# EAGLE design PCI Driver Shield v9001 (EAGLE 9.0.1)
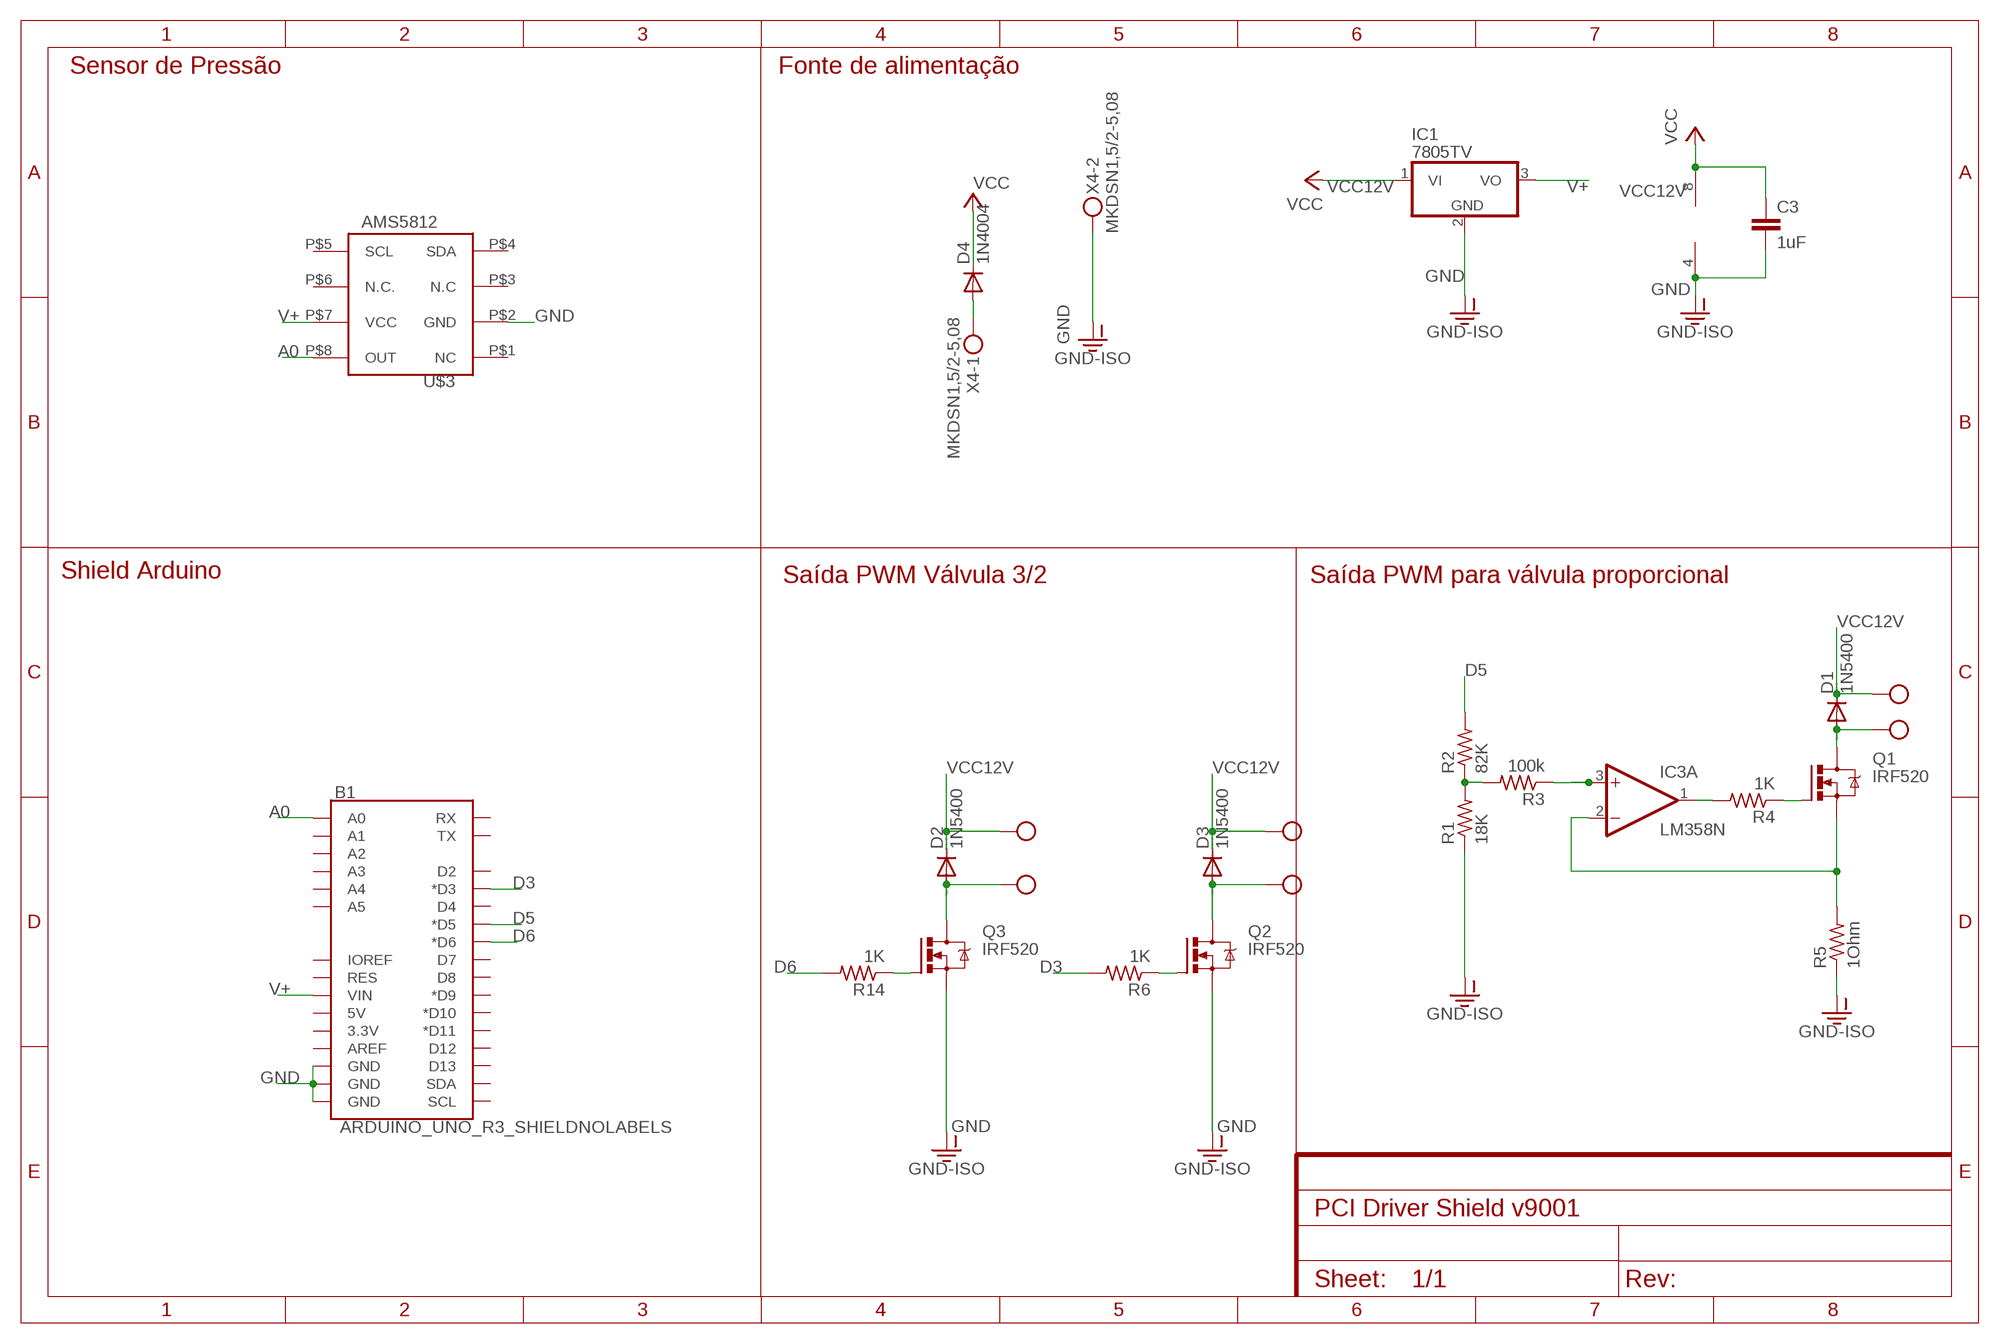
[diagram p0: schematic, sheet 1]

## Parts
B1  ARDUINO_UNO_R3_SHIELDNOLABELS  [UNO_R3_SHIELD_NOLABELS]
C3  1uF  C2.5/4  [C2.5-4]
D1  1N5400  [DO201-15]
D2  1N5400  [DO201-15]
D3  1N5400  [DO201-15]
D4  1N4004  [DO41-10]
IC1  7805TV  [TO220V]
IC3  LM358N  [DIL08]
Q1  IRF520  [TO220BV]
Q2  IRF520  [TO220BV]
Q3  IRF520  [TO220BV]
R1  18K  R-US_0204/7  [0204/7]
R2  82K  R-US_0204/7  [0204/7]
R3  100k  R-US_0204/7  [0204/7]
R4  1K  R-US_0204/7  [0204/7]
R5  1Ohm  R-US_0204/7  [0204/7]
R6  1K  R-US_0204/7  [0204/7]
R14  1K  R-US_0204/7  [0204/7]
S1  MKDSN1,5/2-5,08  [MKDSN1,5/2-5,08]
S2  MKDSN1,5/2-5,08  [MKDSN1,5/2-5,08]
S3  MKDSN1,5/2-5,08  [MKDSN1,5/2-5,08]
U$3  AMS5812  [AMS5812]
X4  MKDSN1,5/2-5,08  [MKDSN1,5/2-5,08]

## Nets
A0: B1.A0 U$3.P$8(OUT)
D3: B1.D3(*D3) R6.2
D5: B1.D5(*D5) R2.2
D6: B1.D6(*D6) R14.2
GND: B1.GND@0(GND) B1.GND@1(GND) B1.GND@2(GND) C3.2 IC1.2(GND) IC3.4(P:V-) Q2.S Q3.S R1.1 R5.1 U$3.P$2(GND) X4.2 ; supply symbol labelled GND-ISO
GNDS1: IC3.2(A:-IN) Q1.S R5.2
N$1: D2.A Q3.D S2.1
N$2: R1.2 R2.1 R3.2
N$3: Q1.G R4.1
N$4: Q2.G R6.1
N$5: D3.A Q2.D S3.1
N$6: IC3.1(A:OUT) R4.2
N$7: D1.A Q1.D S1.1
N$8: IC3.3(A:+IN) R3.1
N$9: D4.A X4.1
N$15: Q3.G R14.1
V+: B1.VIN IC1.3(VO) U$3.P$7(VCC)
VCC12V: C3.1 D1.C D2.C D3.C D4.C IC1.1(VI) IC3.8(P:V+) S1.2 S2.2 S3.2 ; supply symbol labelled VCC
Unconnected: B1.3.3V B1.5V B1.A1 B1.A2 B1.A3 B1.A4 B1.A5 B1.AREF B1.D2 B1.D4 B1.D7 B1.D8 B1.D9(*D9) B1.D10(*D10) B1.D11(*D11) B1.D12 B1.D13 B1.IOREF B1.RES B1.RX B1.SCL B1.SDA B1.TX IC3.5(B:+IN) IC3.6(B:-IN) IC3.7(B:OUT) U$3.P$1(NC) U$3.P$3(N.C) U$3.P$4(SDA) U$3.P$5(SCL) U$3.P$6(N.C.)

## Notes on the sheet
- Sensor de Pressão | Fonte de alimentação
- Shield Arduino | Saída PWM Válvula 3/2 | Saída PWM para válvula proporcional

## Library data of the parts
B1 = SparkFun-Boards:ARDUINO_UNO_R3_SHIELD: Arduino R3 Shield Footprint Shield form compatible with the Arduino Uno R3. SparkFun Products: MG2639 Cellular Shield <https://www.sparkfun.com/products/13120> MIDI Shield <https://www.sparkfun.com/products/12898> R3 Stackable Headers Kit <https://www.sparkfun.com/products/11417>
C3 = capacitor-wima:C: CAPACITOR naming: grid - package width
D1-D3 = diode:1N5400: DIODE standard rectifier, 3 A, 50 V (Motorola)
D4 = adafruit:1N4004: DIODE General purpose 1N400x type rectifier (With bigger pads) http://www.ladyada.net/library/pcb/eaglelibrary.html
IC1 = linear:78*: Positive VOLTAGE REGULATOR Source: http://cache.national.com/ds/LM/LM78L05.pdf http://www.fairchildsemi.com/ds/LM/LM7805.pdf
IC3 = linear:LM358: OP AMP also LM158; LM258; LM2904 Source: http://cache.national.com/ds/LM/LM158.pdf; SPICEPREFIX: J
Q1 = transistor-power:IRF520: HEXFET Power MOSFET; SPICEPREFIX: Q
Q2 Q3 = transistor-power:IRF520: HEXFET Power MOSFET
R1-R3 R5 R6 R14 = resistor:R-US_: RESISTOR, American symbol
R4 = resistor:R-US_: RESISTOR, American symbol; SPICEPREFIX: R
S1-S3 X4 = con-phoenix-508:MKDSN1,5/2-5,08: MKDSN 1,5/ 2-5,08 Printklemme Nennstrom: 13,5 A Nennspannung: 250 V Rastermaß: 5,08 mm Polzahl: 2 Anschlussart: Schraubanschluss Montage: Löten Anschlussrichtung Leiter/Platine: 0 ° Artikelnummer: 1729128 Source: http://eshop.phoenixcontact.com .. 1729128.pdf
U$3 = AMS:AMS5812: AMS 5812 pressure sensors are a series of highprecision OEM sensors with an analog 0.5 – 4.5 V voltage output and a digital I2C-interface. They are calibrated and compensated for across a wide temperature range of -25 to +85°C. AMS 5812 comes as a dual in-line package (DIP) for assembly on printed circuit boards (PCBs) and is fully operational without the need for any additional components. The electrical connection is made via the DIP solder pins; pressure is connected via two vertical metal tubes. AMS 5812 combines micromachined, high quality piezoresistive measuring cells with a modern, signal conditioning mixed-signal ASIC on a ceramic substrate. This enables high precision measurements and excellent drift and long-term stability. The sensors in the AMS 5812 series are available for various applications and pressure ranges: differential (relative) devices in pressure ranges from 0 – 0.075 PSI up to 0 – 100 PSI, absolute pressure variants for 0 – 15 PSI, 0 - 30 PSI and a barometric type. Bidirectional differential devices are available from -0.075 /+ 0.075 PSI up to -15/ +15 PSI. Custom specific pressure ranges and modifications are available on request.

## Net classes
0 default: width 1.016 mm, drill 0.152 mm, clearance 0.457 mm

## Board
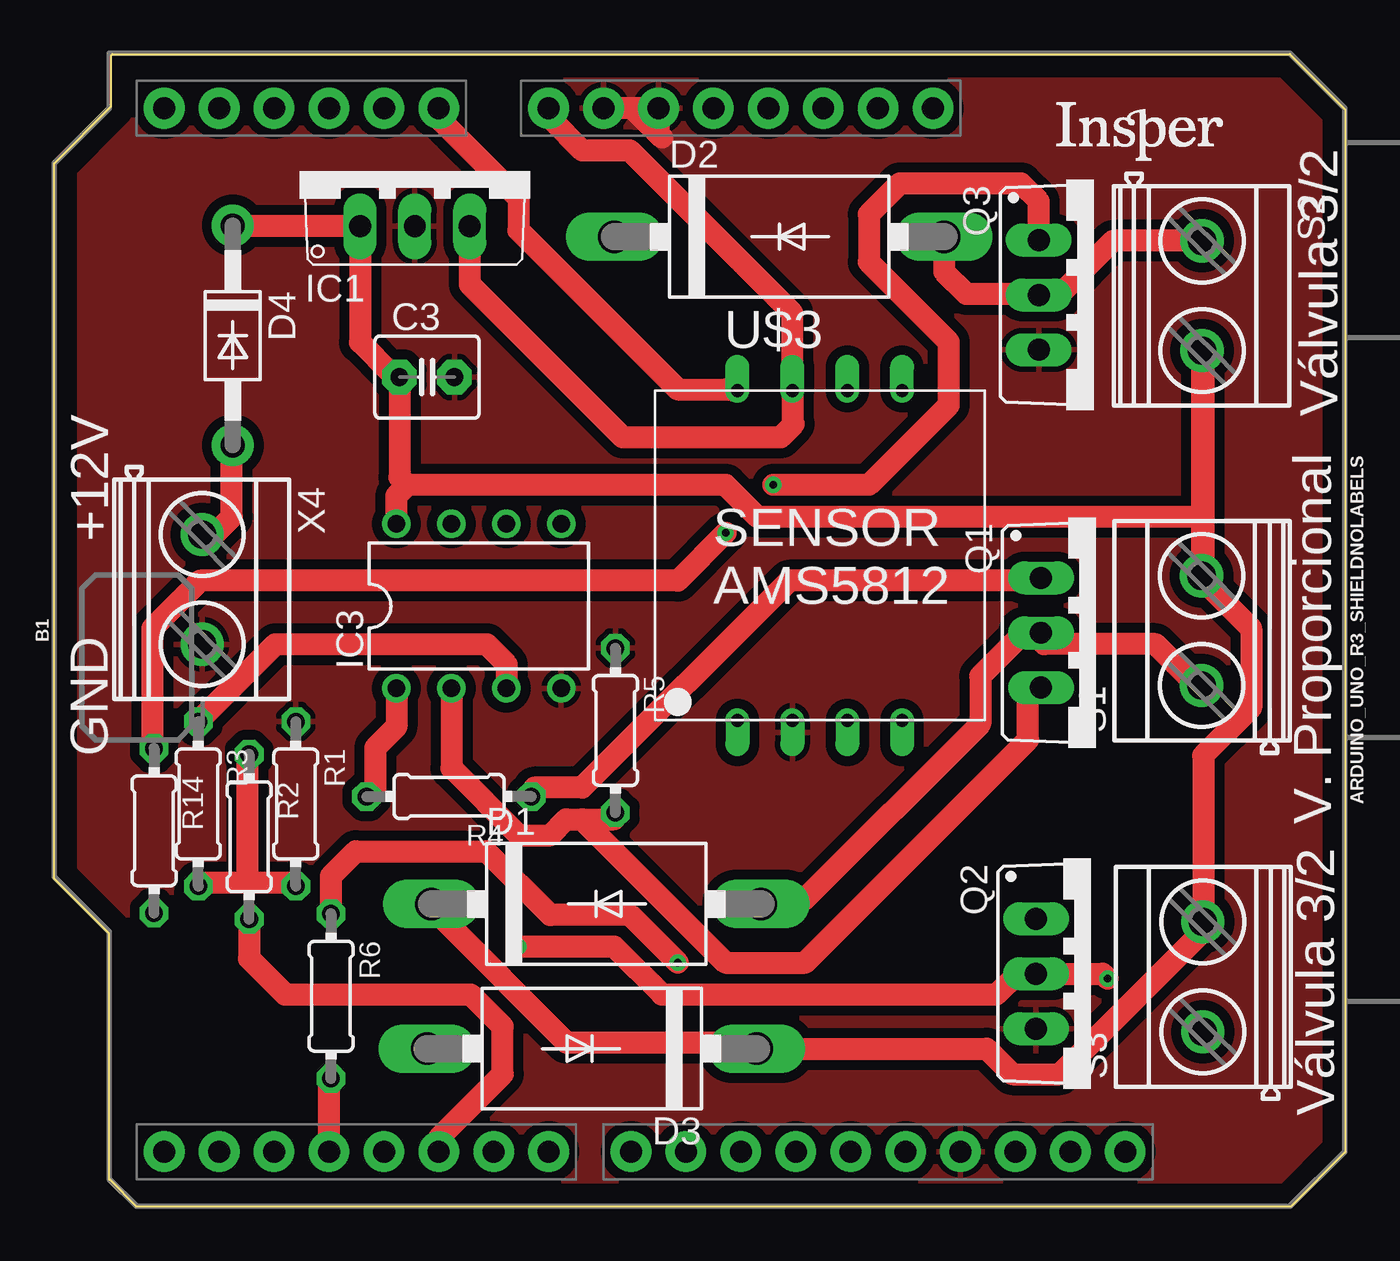
[diagram p1: board, top side]
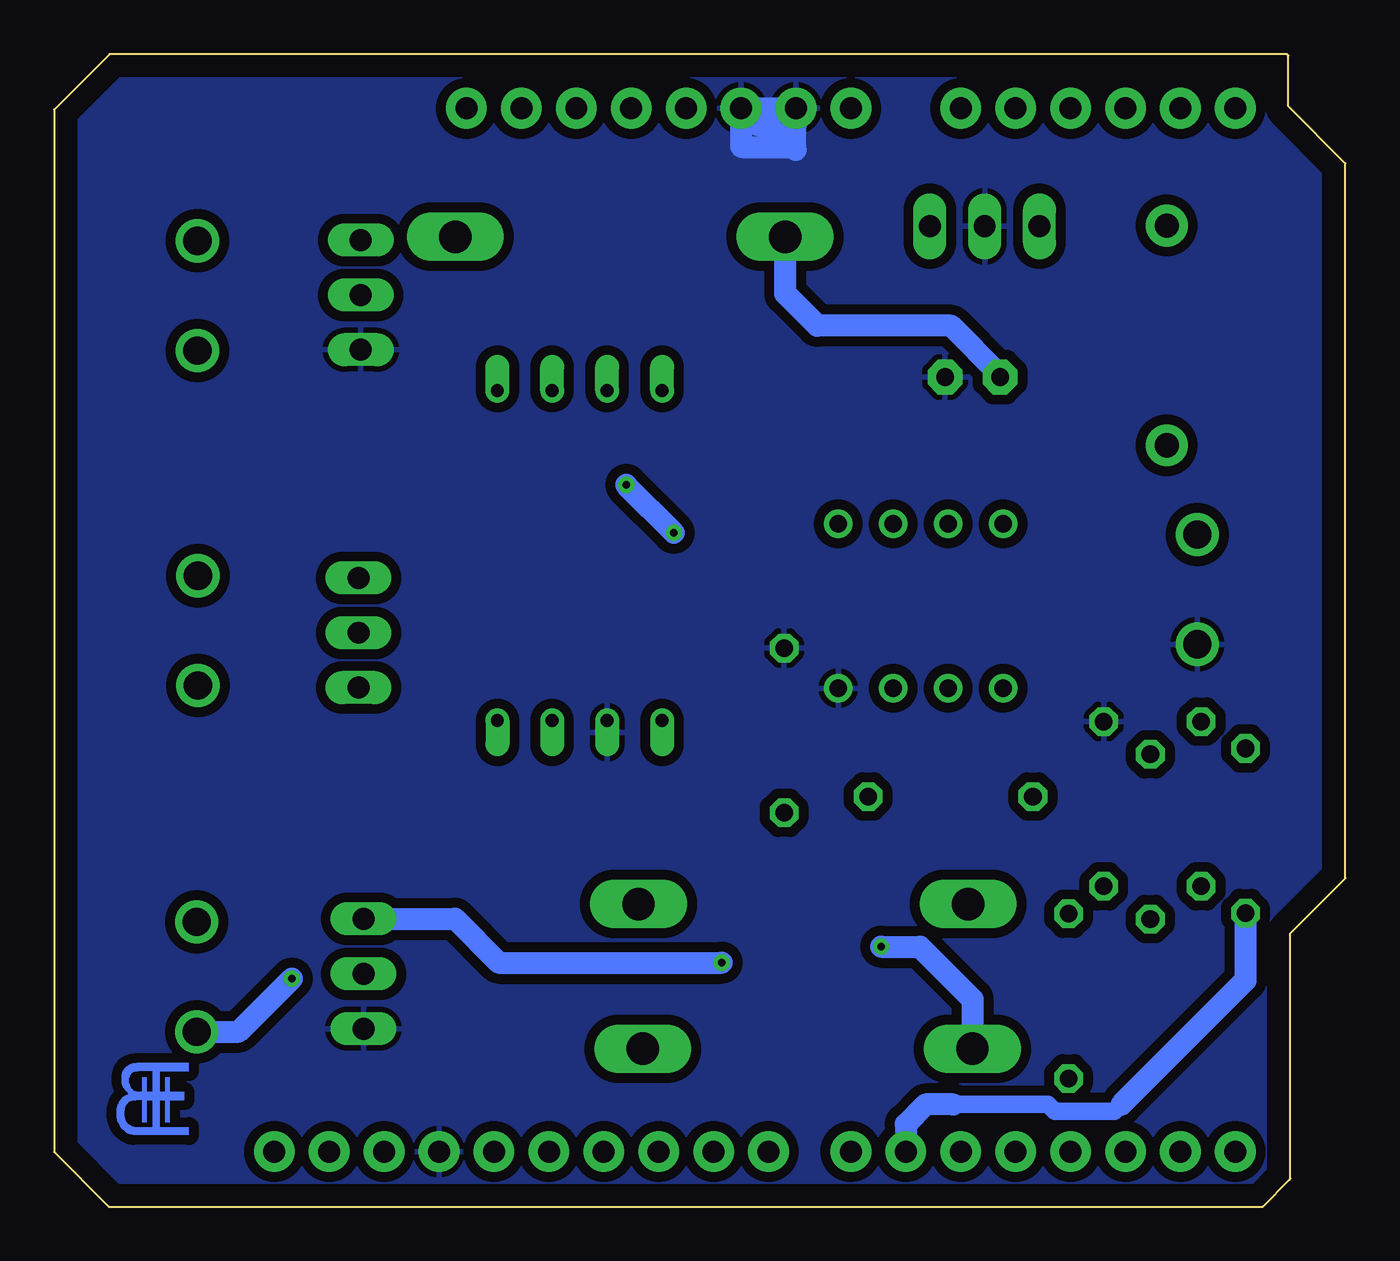
[diagram p2: board, bottom side, seen from below]

Size 59.73 x 53.31 mm. Coordinates in mm from the lower left corner, seen from the top.
Outline: 2.54,1.29 2.54,12.65 0,15.19 0,48.25 2.64,50.89 2.64,53.24 2.71,53.31 57.16,53.31 59.73,50.74 59.73,2.53 57.2,0 3.83,0 2.6,1.23
Outline: 2.61,1.23 2.55,1.29
Copper layers (1*16): Top 0.035mm / dielectric 1.5mm / Bottom 0.035mm
Design rules "default": minimum track width 6mil, minimum drill 0.35mm, track to track 6mil, track to pad 6mil, pad to pad 6mil, via to via 6mil, smd to smd 6mil, copper to edge 40mil, drill to drill 6mil, minimum pad ring 10mil, minimum via ring 8mil, stop-mask expansion 4mil, vias tented up to drill 0mil, thermal gap 10mil

### Footprints (pad centres in the part's own frame; a part is rotated, then mirrored left to right if it is on the bottom)
UNO_R3_SHIELD_NOLABELS = drill 1.016 pad 1.88: 3.3V 24.13,-3.81; 5V 24.13,-1.27; A0 24.13,11.43; A1 24.13,13.97; A2 24.13,16.51; A3 24.13,19.05; A4 24.13,21.59; A5 24.13,24.13; AREF -24.13,-15.24; D2 -24.13,19.05; D3 -24.13,16.51; D4 -24.13,13.97; D5 -24.13,11.43; D6 -24.13,8.89; D7 -24.13,6.35; D8 -24.13,2.54; D9 -24.13,0; D10 -24.13,-2.54; D11 -24.13,-5.08; D12 -24.13,-7.62; D13 -24.13,-10.16; GND@0 24.13,1.27; GND@1 24.13,3.81; GND@2 -24.13,-12.7; IOREF 24.13,-8.89; NC 24.13,-11.43; RES 24.13,-6.35; RX -24.13,24.13; SCL -24.13,-20.32; SDA -24.13,-17.78; TX -24.13,21.59; VIN 24.13,6.35
C2.5-4 = drill 0.813 pad 1.6 octagon: 1 -1.27,0; 2 1.27,0
DO201-15 = drill 1.499 long: A 7.62,0; C -7.62,0
DO41-10 = drill 1.118 pad 1.93: A 5.08,0; C -5.08,0
TO220V = drill 1.016 long: 1 -2.54,-2.54; 2 0,-2.54; 3 2.54,-2.54
DIL08 = drill 0.813 pad 1.27: 1 -3.81,-3.81; 2 -1.27,-3.81; 3 1.27,-3.81; 4 3.81,-3.81; 5 3.81,3.81; 6 1.27,3.81; 7 -1.27,3.81; 8 -3.81,3.81
TO220BV = drill 1.016 long: D 0,-2.54; G -2.54,-2.54; S 2.54,-2.54
0204/7 = drill 0.813 octagon: 1 -3.81,0; 2 3.81,0
MKDSN1,5/2-5,08 = drill 1.3 pad 2: 1 -2.561,0.025; 2 2.519,0.025
AMS5812 = drill 0.6 offset: P$1 3.81,0; P$2 6.35,0; P$3 8.89,0; P$4 11.43,0; P$5 11.43,15.24; P$6 8.89,15.24; P$7 6.35,15.24; P$8 3.81,15.24

### Placement (x,y rotation side)
B1  29.23,26.67 90 top
C3  17.25,38.37 0 top
D1  25.08,14 0 top
D2  33.54,44.86 0 top
D3  24.87,7.3 180 top
D4  8.27,40.29 270 top
IC1  16.69,47.88 0 top
IC3  19.65,27.78 0 top
Q1  48.19,26.54 270 top
Q2  47.96,10.77 270 top
Q3  48.08,42.17 270 top
R1  11.18,18.62 270 top
R2  9.02,17.11 270 top
R3  6.67,18.62 270 top
R4  18.27,18.97 180 top
R5  25.96,22.02 270 top
R6  12.81,9.73 270 top
R14  4.62,17.38 270 top
S1  53.1,26.66 90 top
S2  53.07,42.11 270 top
S3  53.16,10.64 90 top
U$3  27.8,22.49 0 top
X4  6.83,28.53 270 top

### Tracks (layer width: path | path; a pad name or v marks a point on that pad's centre or on a via)
A0
  Top 1.016: U$3.P$8 31.06,37.8 28.85,37.8 21.48,45.16 21.48,46.64 17.8,50.32 B1.A0
D3
  Top 1.016: B1.D3 12.72,5.83 R6.2
D5
  Top 1.016: B1.D5 17.8,3.18 20.75,6.12 20.75,8.33 19.27,9.81 10.69,9.81 9.02,11.47 R2.2
D6
  Bottom 0.813: 18.16,4.73 13.77,4.73 13.44,4.4 10.69,4.4 10.36,4.73
  Bottom 1.016: R14.2 4.62,10.46 10.36,4.73 | 18.16,4.73 19.43,4.73 20.34,3.82 B1.D6
GND
  Top 1.016: 27.96,49.61 B1.GND@0 26.77,50.8 | 27.96,49.61 28.13,49.44 | 27.96,49.61 26.77,50.8 | 26.77,50.8 B1.GND@1
  Bottom 1.016: B1.GND@1 | B1.GND@0 B1.GND@1 | B1.GND@0 27.96,49.04 27.92,49.01 25.56,49.01 25.43,48.88 25.43,50.03 | 25.43,50.03 25.43,50.79 B1.GND@1 | B1.GND@0 27.18,50.03 25.43,50.03
  pour Bottom (isolate 0.254): 3.88,0.02 57.22,0.02 59.75,2.55 59.75,50.71 57.16,53.3 2.69,53.3 2.65,53.25 2.65,50.89 0.01,48.25 0.01,15.17 2.52,12.66 2.52,1.36 3.86,0.03 4.07,0.03
  pour Top (isolate 0.254): -0.06,15.19 2.6,12.54 2.6,1.27 3.93,-0.06 57.14,-0.06 59.72,2.52 59.72,50.73 57.14,53.3 2.56,53.3 2.56,50.76 -0.02,48.19
GNDS1
  Top 1.016: 24.43,17.91 23.69,17.91 22.96,17.17 21.48,17.17 18.38,20.28 IC3.2 | 24.43,17.91 25.9,17.91 R5.2 | 24.43,17.91 31.06,11.28 34.74,11.28 45.05,21.59 45.05,23.8 Q1.S
N$1
  Top 1.016: S2.1 48.98,44.67 46.48,42.17 Q3.D 45.05,42.22 42.2,42.22 41.16,43.25 D2.A
N$2
  Top 1.016: 8.96,14.96 11.17,14.96 R1.2 | 8.96,14.96 6.75,14.96 R3.2 | 8.96,14.96 8.96,20.85 R2.1
N$3
  Top 1.016: R4.1 22.22,19.38 24.43,19.38 34.01,28.96 45.05,28.96 Q1.G
N$4  (via drill 0.35)
  Top 1.016: v28.85,11.28 26.64,13.49 22.96,13.49 20.01,16.44 13.95,16.44 12.81,15.29 12.81,14.14 R6.1
  Bottom 1.016: v28.85,11.28 39.16,11.28 41.19,13.31 Q2.G
N$5  (via drill 0.35)
  Top 1.016: v21.48,12.02 25.9,12.02 28.11,9.81 43.58,9.81 44.55,10.77 Q2.D 48.51,10.77 v48.74,10.54
  Bottom 1.016: S3.1 51.2,8.08 v48.74,10.54 | D3.A 17.25,9.59 19.68,12.02 v21.48,12.02
N$6
  Top 1.016: R4.2 14.85,19.38 14.85,21.22 15.84,22.21 IC3.1
N$7
  Top 1.016: S1.1 52.42,24.54 50.95,26.01 45.79,26.01 Q1.D 45.05,26.75 42.84,24.54 42.84,22.33 34.74,14.23 33.27,14.23 D1.A
N$8
  Top 1.016: R3.1 10.25,26.01 20.01,26.01 20.95,25.07 20.95,24 IC3.3
N$9
  Top 1.016: D4.A 8.22,34.85 8.22,31.9 7.49,31.17 X4.1
N$15  (via drill 0.35)
  Top 1.016: v31.06,31.17 28.85,28.96 6.75,28.96 4.54,26.75 4.54,21.59 R14.1 | v33.27,33.38 37.69,33.38 41.37,37.06 41.37,40.01 37.69,43.69 37.69,45.9 39.11,47.32 44.72,47.32 45.54,46.5 Q3.G
  Bottom 1.016: v33.27,33.38 v31.06,31.17
V+
  Top 1.016: B1.VIN 22.96,50.32 24.43,48.85 26.64,48.85 34.15,41.34 U$3.P$7 34.15,36.12 | IC1.3 19.23,42.66 26.3,35.59 33.61,35.59 34.15,36.12 | 34.15,36.12 34.22,36.2
VCC12V
  Top 1.016: D1.C 17.8,13.49 23.69,7.6 32.2,7.6 D3.C 43.14,7.3 44.32,6.12 46.53,6.12 53.16,12.75 S3.2 53.16,13.49 53.16,20.85 55.37,23.06 55.37,26.75 53.16,28.96 | 53.16,31.9 53.16,39.27 S2.2 53.1,29.02 53.16,28.96 | 53.16,31.9 53.16,29.69 S1.2 53.16,28.96 | 16.33,33.38 31.06,33.38 32.53,31.9 53.16,31.9 | IC3.8 15.84,32.89 16.33,33.38 | 16.33,33.38 15.98,33.72 C3.1 15.59,38.53 14.15,39.98 IC1.1 14.12,45.16 13.91,45.37 D4.C
  Bottom 1.016: D2.C 25.9,44.43 25.9,42.22 24.43,40.74 18.23,40.74 15.98,38.49 C3.1
(copper drawn outside any net)
  shapes: Bottom area x354

### Text on the board
tPlace: +12V | Válvula 3/2 | SENSOR / AMS5812 | GND | V. Proporcional | Válvula 3/2